# Altium project Injection_PCB.PrjPcb
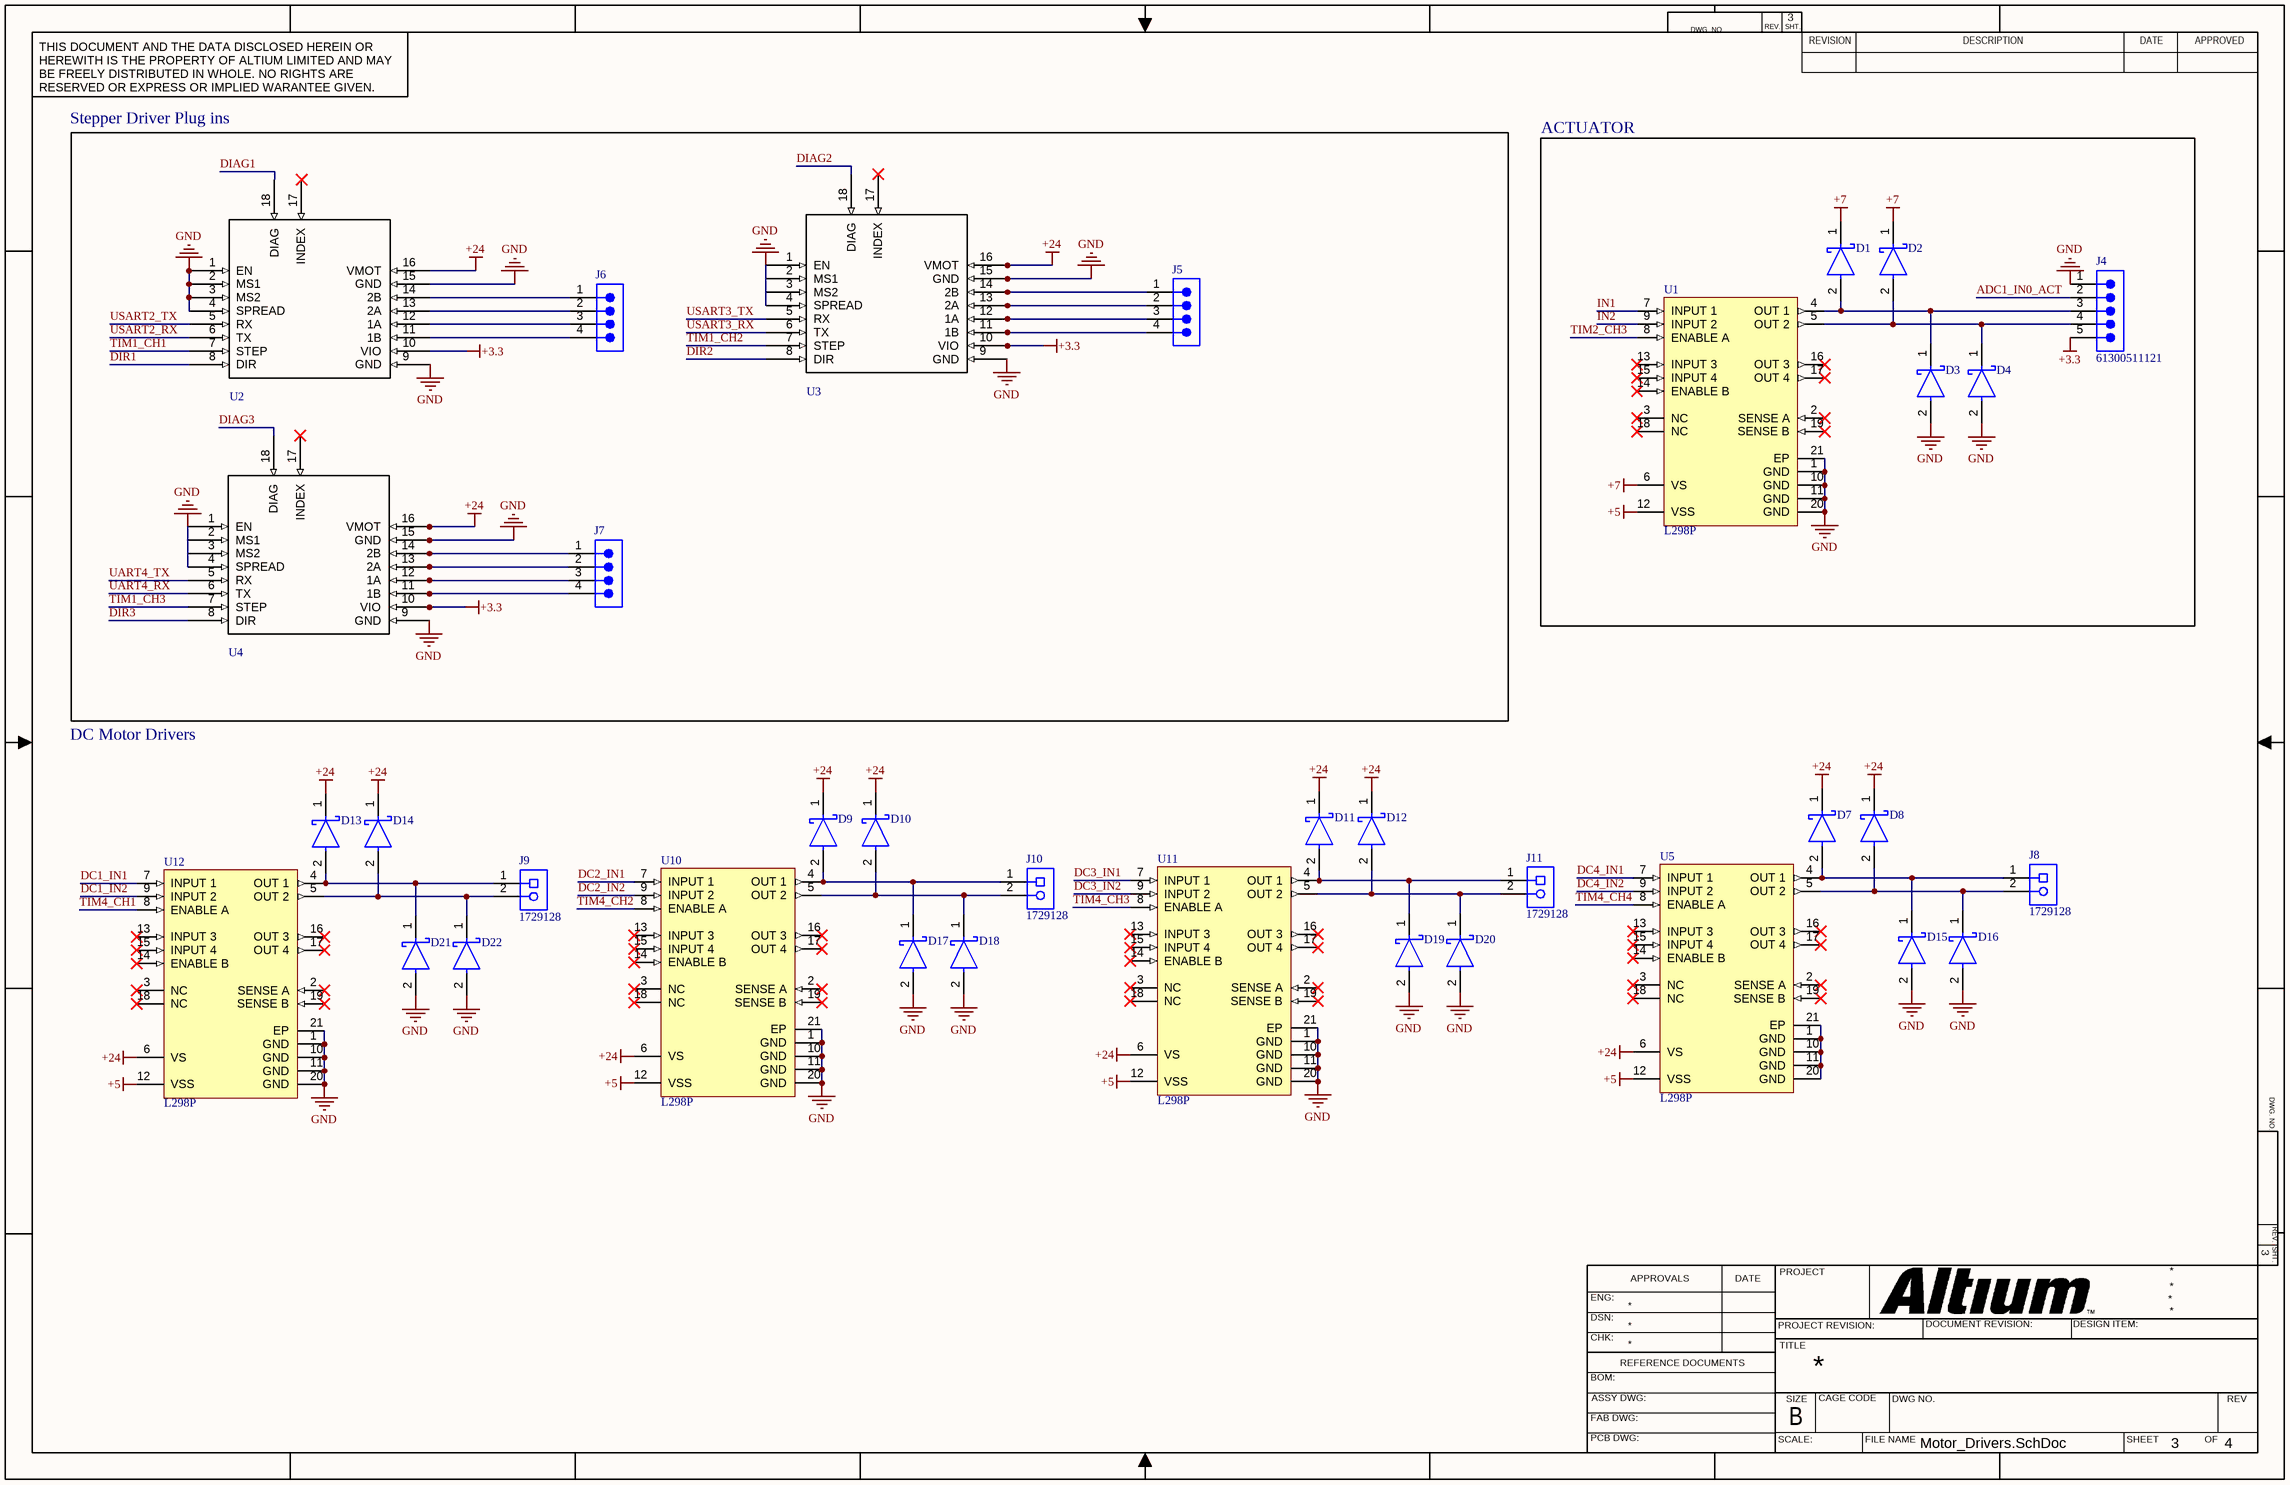
[diagram p0: Motor_Drivers.SchDoc]
2 sheets, 58 parts. Net scope: global (net labels, ports and power ports of the same name join across sheets).
Board file: Injection_PCB.PcbDoc
Sheets:
  Motor_Drivers.SchDoc
  Encoders.SchDoc

## Sheet Motor_Drivers.SchDoc
size 431 x 279 mm; SheetNumber: 3; SheetTotal: 4

### Parts
D1  SSA34-E3/61T  [FP-95400-MFG]  (value not drawn)
D2  SSA34-E3/61T  [FP-95400-MFG]  (value not drawn)
D3  SSA34-E3/61T  [FP-95400-MFG]  (value not drawn)
D4  SSA34-E3/61T  [FP-95400-MFG]  (value not drawn)
D7  SSA34-E3/61T  [FP-95400-MFG]  (value not drawn)
D8  SSA34-E3/61T  [FP-95400-MFG]  (value not drawn)
D9  SSA34-E3/61T  [FP-95400-MFG]  (value not drawn)
D10  SSA34-E3/61T  [FP-95400-MFG]  (value not drawn)
D11  SSA34-E3/61T  [FP-95400-MFG]  (value not drawn)
D12  SSA34-E3/61T  [FP-95400-MFG]  (value not drawn)
D13  SSA34-E3/61T  [FP-95400-MFG]  (value not drawn)
D14  SSA34-E3/61T  [FP-95400-MFG]  (value not drawn)
D15  SSA34-E3/61T  [FP-95400-MFG]  (value not drawn)
D16  SSA34-E3/61T  [FP-95400-MFG]  (value not drawn)
D17  SSA34-E3/61T  [FP-95400-MFG]  (value not drawn)
D18  SSA34-E3/61T  [FP-95400-MFG]  (value not drawn)
D19  SSA34-E3/61T  [FP-95400-MFG]  (value not drawn)
D20  SSA34-E3/61T  [FP-95400-MFG]  (value not drawn)
D21  SSA34-E3/61T  [FP-95400-MFG]  (value not drawn)
D22  SSA34-E3/61T  [FP-95400-MFG]  (value not drawn)
J4  61300511121  [61300511121]
J5  61300411121  [61300411121]  (value not drawn)
J6  61300411121  [61300411121]  (value not drawn)
J7  61300411121  [61300411121]  (value not drawn)
J8  1729128  [PHOE-1729128-2_V]
J9  1729128  [PHOE-1729128-2_V]
J10  1729128  [PHOE-1729128-2_V]
J11  1729128  [PHOE-1729128-2_V]
U1  L298P  [STM-PowerSO20_M]
U2  TMC2209  [TCM2209_breakout]  (value not drawn)
U3  TMC2209  [TCM2209_breakout]  (value not drawn)
U4  TMC2209  [TCM2209_breakout]  (value not drawn)
U5  L298P  [STM-PowerSO20_M]
U10  L298P  [STM-PowerSO20_M]
U11  L298P  [STM-PowerSO20_M]
U12  L298P  [STM-PowerSO20_M]

### Blocks framed on the sheet
Stepper Driver Plug ins: J5-J7 U2-U4
ACTUATOR: D1-D4 J4 U1

### Nets
+3.3: J4.5 U2.10(VIO) U3.10(VIO) U4.10(VIO)
+5: U1.12(VSS) U5.12(VSS) U10.12(VSS) U11.12(VSS) U12.12(VSS)
+7: D1.1(C) D2.1(C) U1.6(VS)
+24: D7.1(C) D8.1(C) D9.1(C) D10.1(C) D11.1(C) D12.1(C) D13.1(C) D14.1(C) U2.16(VMOT) U3.16(VMOT) U4.16(VMOT) U5.6(VS) U10.6(VS) U11.6(VS) U12.6(VS)
GND: D3.2(A) D4.2(A) D15.2(A) D16.2(A) D17.2(A) D18.2(A) D19.2(A) D20.2(A) D21.2(A) D22.2(A) J4.1 U1.1(GND) U1.10(GND) U1.11(GND) U1.20(GND) U1.21(EP) U2.1(EN) U2.2(MS1) U2.3(MS2) U2.4(SPREAD) U2.9(GND) U2.15(GND) U3.1(EN) U3.2(MS1) U3.3(MS2) U3.4(SPREAD) U3.9(GND) U3.15(GND) U4.1(EN) U4.2(MS1) U4.3(MS2) U4.4(SPREAD) U4.9(GND) U4.15(GND) U10.1(GND) U10.10(GND) U10.11(GND) U10.20(GND) U10.21(EP) U11.1(GND) U11.10(GND) U11.11(GND) U11.20(GND) U11.21(EP) U12.1(GND) U12.10(GND) U12.11(GND) U12.20(GND) U12.21(EP)
ADC1_IN0_ACT: J4.2
DC1_IN1: U12.7(INPUT_1)
DC1_IN2: U12.9(INPUT_2)
DC2_IN1: U10.7(INPUT_1)
DC2_IN2: U10.9(INPUT_2)
DC3_IN1: U11.7(INPUT_1)
DC3_IN2: U11.9(INPUT_2)
DC4_IN1: U5.7(INPUT_1)
DC4_IN2: U5.9(INPUT_2)
DIAG1: U2.18(DIAG)
DIAG2: U3.18(DIAG)
DIAG3: U4.18(DIAG)
DIR1: U2.8(DIR)
DIR2: U3.8(DIR)
DIR3: U4.8(DIR)
IN1: U1.7(INPUT_1)
IN2: U1.9(INPUT_2)
TIM1_CH1: U2.7(STEP)
TIM1_CH2: U3.7(STEP)
TIM1_CH3: U4.7(STEP)
TIM2_CH3: U1.8(ENABLE_A)
TIM4_CH1: U12.8(ENABLE_A)
TIM4_CH2: U10.8(ENABLE_A)
TIM4_CH3: U11.8(ENABLE_A)
TIM4_CH4: U5.8(ENABLE_A)
UART4_RX: U4.6(TX)
UART4_TX: U4.5(RX)
USART2_RX: U2.6(TX)
USART2_TX: U2.5(RX)
USART3_RX: U3.6(TX)
USART3_TX: U3.5(RX)
NetD1_2: D1.2(A) D3.1(C) J4.3 U1.4(OUT_1)
NetD2_2: D2.2(A) D4.1(C) J4.4 U1.5(OUT_2)
NetD7_2: D7.2(A) D15.1(C) J8.1 U5.4(OUT_1)
NetD8_2: D8.2(A) D16.1(C) J8.2 U5.5(OUT_2)
NetD9_2: D9.2(A) D17.1(C) J10.1 U10.4(OUT_1)
NetD10_2: D10.2(A) D18.1(C) J10.2 U10.5(OUT_2)
NetD11_2: D11.2(A) D19.1(C) J11.1 U11.4(OUT_1)
NetD12_2: D12.2(A) D20.1(C) J11.2 U11.5(OUT_2)
NetD13_2: D13.2(A) D21.1(C) J9.1 U12.4(OUT_1)
NetD14_2: D14.2(A) D22.1(C) J9.2 U12.5(OUT_2)
NetJ5_1: J5.1 U3.14(2B)
NetJ5_2: J5.2 U3.13(2A)
NetJ5_3: J5.3 U3.12(1A)
NetJ5_4: J5.4 U3.11(1B)
NetJ6_1: J6.1 U2.14(2B)
NetJ6_2: J6.2 U2.13(2A)
NetJ6_3: J6.3 U2.12(1A)
NetJ6_4: J6.4 U2.11(1B)
NetJ7_1: J7.1 U4.14(2B)
NetJ7_2: J7.2 U4.13(2A)
NetJ7_3: J7.3 U4.12(1A)
NetJ7_4: J7.4 U4.11(1B)
NetU5_1: U5.1(GND) U5.10(GND) U5.11(GND) U5.20(GND) U5.21(EP)

Not connected (* = marked no-connect by the designer): U1 2(SENSE_A)* 3(NC)* 13(INPUT_3)* 14(ENABLE_B)* 15(INPUT_4)* 16(OUT_3)* 17(OUT_4)* 18(NC)* 19(SENSE_B)*; U2 17(INDEX)*; U3 17(INDEX)*; U4 17(INDEX)*; U5 2(SENSE_A)* 3(NC)* 13(INPUT_3)* 14(ENABLE_B)* 15(INPUT_4)* 16(OUT_3)* 17(OUT_4)* 18(NC)* 19(SENSE_B)*; U10 2(SENSE_A)* 3(NC)* 13(INPUT_3)* 14(ENABLE_B)* 15(INPUT_4)* 16(OUT_3)* 17(OUT_4)* 18(NC)* 19(SENSE_B)*; U11 2(SENSE_A)* 3(NC)* 13(INPUT_3)* 14(ENABLE_B)* 15(INPUT_4)* 16(OUT_3)* 17(OUT_4)* 18(NC)* 19(SENSE_B)*; U12 2(SENSE_A)* 3(NC)* 13(INPUT_3)* 14(ENABLE_B)* 15(INPUT_4)* 16(OUT_3)* 17(OUT_4)* 18(NC)* 19(SENSE_B)*

### Notes on the sheet
- DC Motor Drivers
- DWG. NO.
- REV.
- SHT.
- THIS DOCUMENT AND THE DATA DISCLOSED HEREIN OR HEREWITH IS THE PROPERTY OF ALTIUM LIMITED AND MAY BE FREELY DISTRIBUTED IN WHOLE. NO RIGHTS ARE RESERVED OR EXPRESS OR IMPLIED WARANTEE GIVEN.
- REVISION
- DESCRIPTION
- DATE
- APPROVED
- ENG:
- APPROVALS
- PROJECT
- DSN:
- CHK:
- REFERENCE DOCUMENTS
- PROJECT REVISION:
- TITLE
- DOCUMENT REVISION:
- DESIGN ITEM:
- BOM:
- FAB DWG:
- PCB DWG:
- ASSY DWG:
- SCALE:
- SIZE
- B
- CAGE CODE
- FILE NAME
- DWG NO.
- SHEET
- OF
- REV

### Library data of the parts
D1-D4 D7-D22 = CMP-02539-000022-2: DIODE SCHOTTKY 40V 3A DO214AC; Element Configuration: Single; Max Reverse Leakage Current: 200uA; Polarity: Standard; Peak Non-Repetitive Surge Current: 75A; Forward Voltage: 490mV; Radiation Hardening: No; Current Rating: 3A; Contact Plating: Tin; Output Current: 3A; Height: 2.087mm; Mount: Surface Mount; Case/Package: SMA; Packaging: Tape and Reel; Width: 2.79mm; Average Rectified Current: 3A; Max Repetitive Reverse Voltage (Vrrm): 40V; Max Operating Temperature: 150°C; Length: 4.5mm; RoHS Compliant: Yes; Max Reverse Current: 200uA; Voltage Rating (DC): 40V; Min Operating Temperature: -65°C; Max Reverse Voltage (DC): 40V; Number of Pins: 2; Max Forward Surge Current (Ifsm): 75A; Lead Free: Lead Free; Forward Current: 3A; Max Surge Current: 75A; Package Quantity: 1; LCSC: C466998
J4 = CMP-1502-01068-3: NexarPartId: 32855526; Connector Type: Male Pin; Gender: Male; Contact Resistance: 20mΩ; Pitch: 2.54mm; Operating Supply Voltage: 250V; Current Rating: 3A; Number of Contacts: 5; Lead Free: Lead Free; Color: Black; Packaging: Bulk; Lead Pitch: 2.54mm; Contact Material: Copper; Min Operating Temperature: -40°C; Contact Mating Length: 5.9944mm; Voltage Rating: 250V; Number of Pins: 5; Number of Positions: 5; Height: 8.89mm; Orientation: Vertical; REACH SVHC: Unknown; RoHS: Compliant; Contact Plating: Gold; Max Operating Temperature: 105°C; Mount: Through Hole; Number of Rows: 1; Termination: Solder
J5-J7 = CMP-1502-01064-3: NexarPartId: 32855522; Operating Supply Voltage: 250V; Pitch: 2.54mm; Contact Resistance: 20mΩ; Number of Positions: 4; Current Rating: 3A; Connector Type: Male Pin; Gender: Male; Contact Plating: Gold; Height: 8.89mm; Lead Pitch: 2.54mm; Lead Free: Lead Free; Contact Mating Length: 5.9944mm; Number of Rows: 1; Termination: Solder; Packaging: Bulk; REACH SVHC: Unknown; Min Operating Temperature: -40°C; RoHS: Compliant; Number of Contacts: 4; Voltage Rating: 250V; Color: Black; Max Operating Temperature: 105°C; Contact Material: Copper; Mount: Through Hole; Orientation: Vertical; Number of Pins: 4
J8-J11 = CMP-2000-05815-1: PCB Terminal Block, 13.5 A, 400 V, 2-Pin THD, RoHS, Bulk; Manufacturer: Phoenix Contact; Package Version: 03/2015; No. of Rows: 1; Pitch: 5.08mm; No. of Positions: 2; Voltage Rating: 400V; Current Rating: 13500mA; Manufacturer URL: http://www.phoenixcontact.com/; Datasheet URL: https://datasheet.ciiva.com/16046/1729128-16046181.pdf; RoHS: TRUE; Package URL: https://www.phoenixcontact.com/online/portal/pi/pxc/product_detail_page/!ut/p/b1/3VdJjqNKFDxLH8AFycySyWY2ozFsEPOMMQaDOX1XedGL_1Vdm5YXJleknhSKeBkvI6EA8ncAo3AYoDhBQGco6KN7VURTdemj9us_IEKEZo_YHiPAEWEFmDGOHMORkqKYCORBZxgL7ZoaZYcbFFUZ3fqxSY6GOuxydWUuHqz1ynmMFygu583Bob0Ewr6Sd_l-5m-kAueHiB0jpRwZwe58wwtkpxtMYd_LmGcDRU02dRNEyWt6Y2ti5pSyJ_reIkzIulrqApdnbT11V5jnCKbYNCvhEM1MCpPByat_X379-iThf08CI5GfOPqfBeS3BRoBOdD55AKVv0iLwCMq-2BrzXWSGRH7pUGD9uwXQjiph3xL0DKQwdGa0JImiIOmBNOestqgwTHSSs2oOep-78apyXQBvNi8ZLaFjvjWvcaUEBu0MC6Wbe-d6mB0FAebo2lUWinqYaZs5DAYzV0RP9yitUjnGJ0iI9xhZkT42OCQNUJJhkgWINNQLP2JFP6OpMg3JCVg70jqHT0lvKOnhHf0lPuOnnLf0VPuWx6_dxwUIvwk5WMkT0kLL1mh61l2yZVSzG3pYV_bqo-mj6uMKwKwdnnW8Jh5RTOJzMOA5c-eJDaZQw4mTMPH02PvS_ZAqNVjVTo2WyYLkwH_KU1mmmG5kjRhDqPXLwwVHvVOjCM60-fpXvTDfMGW1PVFVS1r4e4yVDk4ZdNbkUHvqPqQSeian4UD39fNKmachqdJ1NJbyk8rXT9mXTvPk3oE5meulKGgiruPJek-4I9hTT6G8ZLOyRSm2RRVbThERQad5OS28hdt4YW4vG0stgYYzsWsK4_7y6DZMjJSCqri1kyiZR5vD7pwIrNR7QwPHTcLTI5qT7eRlpHrdGiupYlqQDJ7zy_CND8fWWBoLRXxk1RVcXiBQwbTD4Xi7KL-FuO94t9xaqweXzH; PartNumber: 1729128; Package Description: 2-Pin Through Hole Device, Body 8.1 x 10.16 mm, Pitch 5.08 mm; Datasheet Version: 12/2013; Mounting Technology: ThroughHole; Orientation: Horizontal; Package Reference: 1729128-2; Packing: Bulk
U1 U5 U10-U12 = CMP-2100-03649-1: Dual Full-Bridge Driver, 4.5 to 7 V, -25 to 130 degC, 20-Pin SOIC, RoHS, Tube; Manufacturer: STMicroelectronics; Output Current: 2A; Collector Emitter Voltage (VCEO): 46V; Min Supply Voltage: 4.8V; Max Collector Current: 3A; Supply Voltage: 42V; Number of Channels: 2; Operating Supply Current: 13mA; Packaging: Rail/Tube; Package Reference: PowerSO20; Width: 11.1mm; Radiation Hardening: No; Height: 3.3mm; Lead Free: LeadFree; Datasheet Version: 36526.0; Datasheet URL: http://www.st.com/content/ccc/resource/technical/document/datasheet/82/cc/3f/39/0a/29/4d/f0/CD00000240.pdf/files/CD00000240.pdf/jcr:content/translations/en.CD00000240.pdf; RoHSCompliant: true; Max Supply Voltage: 46V; Output Current per Channel: 2A; Package Description: 20-Pin Small Outline Integrated Circuits, Body 15.9 x 11 mm, Pitch 1.27 mm; Case/Package: SOIC; Min Operating Temperature: -25degC; Number of Pins: 20; Length: 16mm; Max Output Current: 3A; Package Quantity: 31; Max Operating Temperature: 130degC; Mount: SurfaceMount; Manufacturer URL: http://www.st.com/; LCSC: C17179540
U2-U4 = TMC2209_plug

## Sheet Encoders.SchDoc
size A; SheetNumber: 4; SheetTotal: 4
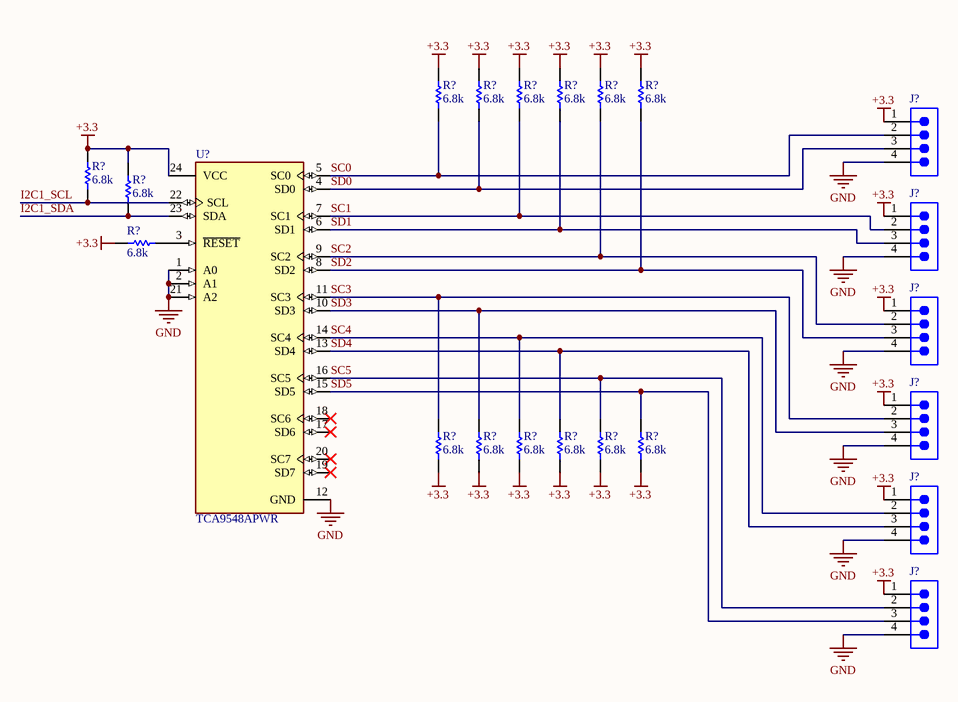
[diagram p1: Encoders.SchDoc]

### Parts
(Parts that share a designator on the sheet are numbered #1, #2 ... from top to bottom, then left to right.)
J?#1  61300411121  [61300411121]  (value not drawn)
J?#2  61300411121  [61300411121]  (value not drawn)
J?#3  61300411121  [61300411121]  (value not drawn)
J?#4  61300411121  [61300411121]  (value not drawn)
J?#5  61300411121  [61300411121]  (value not drawn)
J?#6  61300411121  [61300411121]  (value not drawn)
R?#1  value 6.8k  [RESC1609X50X30LL10T20]  (hidden comment: CRCW06036K80FKEA)
R?#2  value 6.8k  [RESC1609X50X30LL10T20]  (hidden comment: CRCW06036K80FKEA)
R?#3  value 6.8k  [RESC1609X50X30LL10T20]  (hidden comment: CRCW06036K80FKEA)
R?#4  value 6.8k  [RESC1609X50X30LL10T20]  (hidden comment: CRCW06036K80FKEA)
R?#5  value 6.8k  [RESC1609X50X30LL10T20]  (hidden comment: CRCW06036K80FKEA)
R?#6  value 6.8k  [RESC1609X50X30LL10T20]  (hidden comment: CRCW06036K80FKEA)
R?#7  value 6.8k  [RESC1609X50X30LL10T20]  (hidden comment: CRCW06036K80FKEA)
R?#8  value 6.8k  [RESC1609X50X30LL10T20]  (hidden comment: CRCW06036K80FKEA)
R?#9  value 6.8k  [RESC1609X50X30LL10T20]  (hidden comment: CRCW06036K80FKEA)
R?#10  value 6.8k  [RESC1609X50X30LL10T20]  (hidden comment: CRCW06036K80FKEA)
R?#11  value 6.8k  [RESC1609X50X30LL10T20]  (hidden comment: CRCW06036K80FKEA)
R?#12  value 6.8k  [RESC1609X50X30LL10T20]  (hidden comment: CRCW06036K80FKEA)
R?#13  value 6.8k  [RESC1609X50X30LL10T20]  (hidden comment: CRCW06036K80FKEA)
R?#14  value 6.8k  [RESC1609X50X30LL10T20]  (hidden comment: CRCW06036K80FKEA)
R?#15  value 6.8k  [RESC1609X50X30LL10T20]  (hidden comment: CRCW06036K80FKEA)
U?  TCA9548APWR  [FP-PW0024A-MFG]

### Nets
+3.3: J?#1.1 J?#2.1 J?#3.1 J?#4.1 J?#5.1 J?#6.1 R?#1.2 R?#2.2 R?#3.2 R?#4.2 R?#5.2 R?#6.2 R?#7.2 R?#8.2 R?#9.2 R?#10.1 R?#11.1 R?#12.1 R?#13.1 R?#14.1 R?#15.1 U?.24(VCC)
GND: J?#1.4 J?#2.4 J?#3.4 J?#4.4 J?#5.4 J?#6.4 U?.1(A0) U?.2(A1) U?.12(GND) U?.21(A2)
I2C1_SCL: R?#7.1 U?.22(SCL)
I2C1_SDA: R?#8.1 U?.23(SDA)
SC0: J?#1.2 R?#1.1 U?.5(SC0)
SC1: J?#2.2 R?#3.1 U?.7(SC1)
SC2: J?#3.2 R?#5.1 U?.9(SC2)
SC3: J?#4.2 R?#10.2 U?.11(SC3)
SC4: J?#5.2 R?#12.2 U?.14(SC4)
SC5: J?#6.2 R?#14.2 U?.16(SC5)
SD0: J?#1.3 R?#2.1 U?.4(SD0)
SD1: J?#2.3 R?#4.1 U?.6(SD1)
SD2: J?#3.3 R?#6.1 U?.8(SD2)
SD3: J?#4.3 R?#11.2 U?.10(SD3)
SD4: J?#5.3 R?#13.2 U?.13(SD4)
SD5: J?#6.3 R?#15.2 U?.15(SD5)
NetR?#9_1: R?#9.1 U?.3(~{RESET})

Not connected (* = marked no-connect by the designer): U? 17(SD6)* 18(SC6)* 19(SD7)* 20(SC7)*

### Library data of the parts
J?#1-J?#6 = CMP-1502-01064-3: as J5 on sheet Motor_Drivers; Contact Plating: Gold; Height: 8.89mm; Lead Pitch: 2.54mm; Lead Free: Lead Free; Contact Mating Length: 5.9944mm; Number of Rows: 1; Termination: Solder; Packaging: Bulk; REACH SVHC: Unknown; Min Operating Temperature: -40°C; RoHS: Compliant; Number of Contacts: 4; Voltage Rating: 250V; Color: Black; Max Operating Temperature: 105°C; Contact Material: Copper; Mount: Through Hole; Orientation: Vertical; Number of Pins: 4
R?#1-R?#15 = CMP-2000-03550-1: Manufacturer: Vishay Dale; Part Number: CRCW06036K80FKEA; LCSC: C269697
U? = CMP-04892-000002-1: IC I2C SW 8CH W/RESET 24TSSOP; Manufacturer: Texas Instruments; Number Of Circuits: 1; Mux Demux Ratio: 1:8; Nominal Supply Current: 2-50uA; Interface: I2C,SMBus; Min Supply Voltage: 1.65V; Standoff Height: 0.05mm; Description: Bus Switch 1 x 8:1 24-TSSOP; Max Supply Voltage: 5.5V; Device Class L2: Interface ICs; ComponentLink2Description: Datasheet; Ipc Land Pattern Name: SOP65P640X120-24; Category: IC; Device Class L1: Integrated Circuits (ICs); Manufacturer Part Number: TCA9548APWR; RoHS: TRUE; Temperature Range High: +85°C; Digikey Description: IC I2C SW 8CH W/RESET 24TSSOP; Temperature Range Low: -40°C; Lead Free: Yes; Package: PW0024A; ComponentLink2URL: http://www.ti.com/lit/ds/symlink/tca9548a.pdf; Device Class L3: Multiplexers; Ambient Temperature Range Low: -40°C; Mouser Description: Low-Voltage 8-Channel I2C Switch With Reset 24-TSSOP -40 to 85; Temperature: -40°C to +85°C; Octopart: https://octopart.com/tca9548apwr-texas+instruments-22266789; Ambient Temperature Range High: +85°C; Automotive: No; Height: 1.2mm

## Nets that join several sheets
+3.3: Motor_Drivers (J4.5 U2.10 U3.10 U4.10), Encoders (22 pins)
GND: Motor_Drivers (49 pins), Encoders (10 pins)